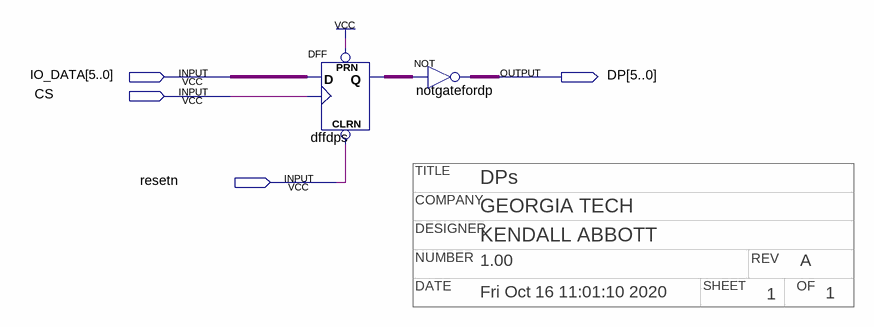
[diagram p0: schematic sheet]
// Quartus schematic DPs.bdf as structural Verilog: 2 symbols, 4 pins
// Title block: COMPANY: GEORGIA TECH; DATE: Fri Oct 16 11:01:10 2020; DESIGNER: KENDALL ABBOTT; NUMBER: 1.00; OF: 1; REV: A; SHEET: 1; TITLE: DPs
module DPs (
  input  [5:0] IO_DATA,
  input  CS,
  input  resetn,
  output [5:0] DP
);

  wire [5:0] dffdps_q;

  DFF dffdps[5:0] (.CLRN(resetn), .CLK(CS), .D(IO_DATA), .PRN(1'b1), .Q(dffdps_q));
  assign DP = ~dffdps_q;  // NOT notgatefordp, 6 bits wide
endmodule
